# Altium schematic sheet pwr.SchDoc: Robot Control PCB
size A4; Revision: 0.1; SheetNumber: 5; SheetTotal: 5; DrawnBy: OYSM; ProjectNumber: 1; DocumentSize: A4; PCAName: robot_control_pcb
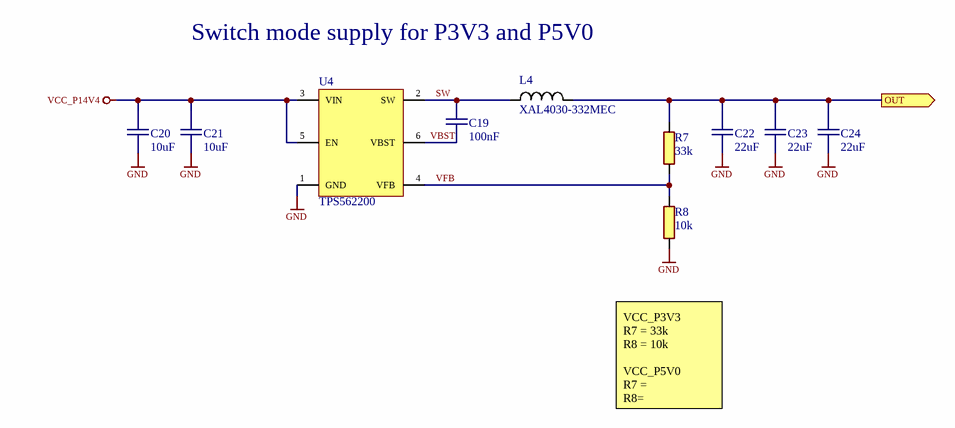
[diagram p0: pwr.SchDoc]

## Parts
C19  100nF  [CAPC0603(1608)55_N]
C20  10uF  [CAPC1206(3216)170_N]
C21  10uF  [CAPC1206(3216)170_N]
C22  22uF  [CAPC1206(3216)170_N]
C23  22uF  [CAPC1206(3216)170_N]
C24  22uF  [CAPC1206(3216)170_N]
L4  XAL4030-332MEC  [XAL4030]
R7  33k  [RESC0603(1608)_N]
R8  10k  [RESC0603(1608)_N]
U4  TPS562200  [SOT95P280X145-6N]

## Ports
OUT (out)

## Nets
GND: C20.1 C21.1 C22.1 C23.1 C24.1 R8.1 U4.1(GND)
VCC_P14V4: C20.2 C21.2 U4.3(VIN) U4.5(EN)
OUT: C22.2 C23.2 C24.2 L4.2 R7.2 ; port OUT
SW: C19.2 L4.1 U4.2(SW)
VBST: C19.1 U4.6(VBST)
VFB: R7.1 R8.2 U4.4(VFB)

## Notes on the sheet
- Switch mode supply for P3V3 and P5V0
- VCC_P3V3
  R7 = 33k
  R8 = 10k
  VCC_P5V0
  R7 =
  R8=
- Title
- Size
- Date:
- A4
- Project Number
- Sheet         of
- Revision
- File:
- Drawn By:

## Library data of the parts
C19 = 5152: X7R 50V 5%; id: 5152; rad: 21; rom: OV; lager_type: Baklager; dybde: 0; antall: 1000; pakke_opprettet_av: 815; leverandor_varenr: 1759122; pris: 1; nokkelord: Kondensator, Capacitor, CAP; produsent: Multikomp; leverandor: Farnell; pakketype: 0603; komponenttype: 2; hylle: 0; pakke_opprettet: 18.02.2015 14:18:13; symbol_opprettet_av: 815; symbol_opprettet: 14.11.2014 20:19:34; navn: 100nF
C20 C21 = 5059: X5R 50V 10%; id: 5059; pakke_opprettet_av: 815; leverandor_varenr: 1845762; pris: 6; nokkelord: Kondensator, capacitor; produsent: Murata; leverandor: Farnell; pakketype: 1206; komponenttype: 2; pakke_opprettet: 11.02.2015 13:21:22; symbol_opprettet_av: 815; symbol_opprettet: 14.11.2014 20:19:34; navn: 10uF
C22-C24 = 5192: 10V 10% Tantalum; id: 5192; pakke_opprettet_av: 815; leverandor_varenr: 1457420; pris: 3; nokkelord: Capacitor Cap Kondis; produsent: Kemet; leverandor: Farnell; pakketype: 1206; komponenttype: 2; pakke_opprettet: 11.02.2015 13:21:22; symbol_opprettet_av: 815; symbol_opprettet: 14.11.2014 20:19:34; navn: 22uF
L4 = 5644: 3.3µH; id: 5644; pakke_opprettet_av: 815; symbol_opprettet_av: 924; leverandor_varenr: 2289055; pris: 40; nokkelord: 3.3uH, 3u3H, 3,3uH, 3µ3H; produsent: Coilcraft; leverandor: Farnell; pakketype: SMD; komponenttype: 3; pakke_opprettet: 23.01.2020 22:27:27; symbol_opprettet: 27.05.2015 00:20:21; navn: XAL4030-332MEC
R7 = 5397: 0.1W 1% Thick film resistor; id: 5397; rad: -1; rom: OV; lager_type: Fremlager; dybde: 84; hylle: 2; antall: 100; pakke_opprettet_av: 815; pris: 0; pakketype: 0603; komponenttype: 1; pakke_opprettet: 08.07.2014 21:15:30; symbol_opprettet_av: 815; symbol_opprettet: 08.07.2014 21:16:33; navn: 33k
R8 = 5264: 0.1W 1% Thick film resistor; id: 5264; rad: 1; rom: OV; lager_type: Baklager; dybde: 3; hylle: 6; antall: 1200; pakke_opprettet_av: 815; leverandor_varenr: 2447230; pris: 0; nokkelord: Resistor Motstand; produsent: Multikomp; leverandor: Farnell; pakketype: 0603; pakke_opprettet: 08.07.2014 21:15:30; symbol_opprettet_av: 815; symbol_opprettet: 08.07.2014 21:16:33; navn: 10k; komponenttype: 1
U4 = 5645: id: 5645; pakke_opprettet_av: 1335; symbol_opprettet_av: 815; beskrivelse: DC-DC Switching Buck Step Down Regulator, Adjustable, 4.5V-17Vin, 760mV-7Vout, 2Aout; leverandor_varenr: 2420234; pris: 12; produsent: Texas Instruments; leverandor: Farnell; pakketype: SOT-23; komponenttype: 15; pakke_opprettet: 25.11.2016 18:04:01; symbol_opprettet: 23.01.2020 22:46:07; navn: TPS562200